# Altium schematic sheet 6_Auxilaries.SchDoc
size A4
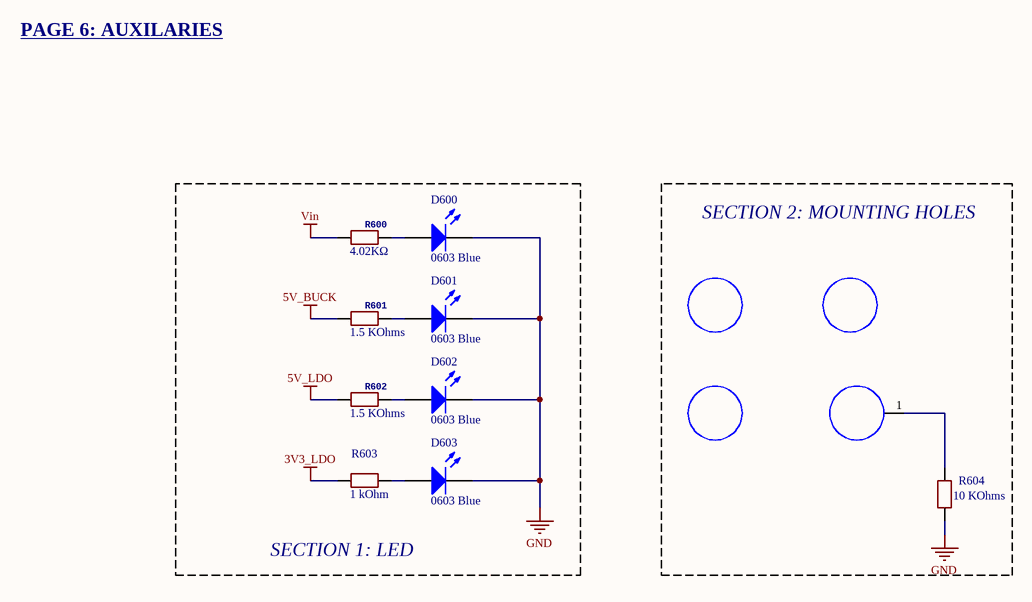
[diagram p0: 6_Auxilaries.SchDoc]

## Parts
D600  0603 Blue  [0603_LED_S1]
D601  0603 Blue  [0603_LED_S1]
D602  0603 Blue  [0603_LED_S1]
D603  0603 Blue  [0603_LED_S1]
H600  M3 not plated  [M3 not plated]  (value not drawn)
H601  M3 not plated  [M3 not plated]  (value not drawn)
H602  M3 plated  [M3 plated]  (value not drawn)
H603  M3 not plated  [M3 not plated]  (value not drawn)
R600  value 4.02KΩ  [RES_0603]  (hidden comment: ERA3AEB4021V)
R601  value 1.5 KOhms  [RES_0603]  (hidden comment: ERJ3EKF1501V)
R602  value 1.5 KOhms  [RES_0603]  (hidden comment: ERJ3EKF1501V)
R603  value 1 kOhm  [RES_0603]  (hidden comment: ERJ3GEYJ102V)
R604  value 10 KOhms  [RES_0603]  (hidden comment: ERJ3GEYJ103V)

## Blocks framed on the sheet
SECTION 1: LED: D600-D603 R600-R603
SECTION 2: MOUNTING HOLES: H600-H603 R604

## Nets
3V3_LDO: R603.1
5V_BUCK: R601.1
5V_LDO: R602.1
GND: D600.K D601.K D602.K D603.K R604.2
Vin: R600.1
NetD600_A: D600.A R600.2
NetD601_A: D601.A R601.2
NetD602_A: D602.A R602.2
NetD603_A: D603.A R603.2
NetH602_1: H602.1 R604.1

## Notes on the sheet
- PAGE 6: AUXILARIES

## Library data of the parts
D600-D603 = 0603 LED Blue: LED; ComponentLink1Description: 供应商链接; ComponentLink1URL: http://www.szlcsc.com/product/details_73150.html; Package: 0603; Supplier: LC; SuppliersPartNumber: C72041; Color: Blue
H600 H601 H603 = M3 not plated: M3 hole not plated
H602 = M3 plated: M3 hole plated
R600 = ERA3AEB4021V: Res 4.02KOhm 1/10W 0603; Manufacturer_Name: Panasonic; PartNumber: ERJ3GEYJ200V; Link: https://www.digikey.ca/en/products/detail/panasonic-electronic-components/ERA-3AEB4021V/2026802?s=N4IgTCBcDaIKICUCCBmJcBCAWADGAjAGogC6AvkA; Package: 0603; SupplierPartNumber: P4.02KDBTR-ND; SuppliersPartNumber: C491130
R601 R602 = ERJ3EKF1501V: Res 1.5KOhms 1/10W 0603; Link: https://www.digikey.ca/en/products/detail/panasonic-electronic-components/ERJ-3EKF1501V/196052?s=N4IgTCBcDaIKICUBSBmOBpAYgRgKwAZsA1EAXQF8g; Package: 0603; PartNumber: ERJ3EKF1501V; SupplierPartNumber: P1.50KHTR-ND; SuppliersPartNumber: C193392
R603 = ERJ3GEYJ102V: Res 1kOhm 1/10W 0603; Manufacturer_Name: Panasonic; SymbolName_1: ERJ3GEYJ102V; Link: https://www.digikey.ca/en/products/detail/panasonic-electronic-components/ERJ-3GEYJ102V/68472?s=N4IgTCBcDaIKICUBSBmA4nAmkgjABjADUQBdAXyA; Package: 0603; PartNumber: ERJ3GEYJ102V; SupplierPartNumber: P1.0KGCT-ND; SuppliersPartNumber: C180848
R604 = ERJ3GEYJ103V: Res 10KOhms 1/10W 0603; Link: https://www.mouser.ca/ProductDetail/Panasonic/ERJ-3GEYJ103V?qs=66DK8nO8gJBWgc%252B0VNNxzg%3D%3D; Package: 0603; PartNumber: ERJ3GEYJ103V; SupplierPartNumber: 667-ERJ-3GEYJ103V; SuppliersPartNumber: C169849